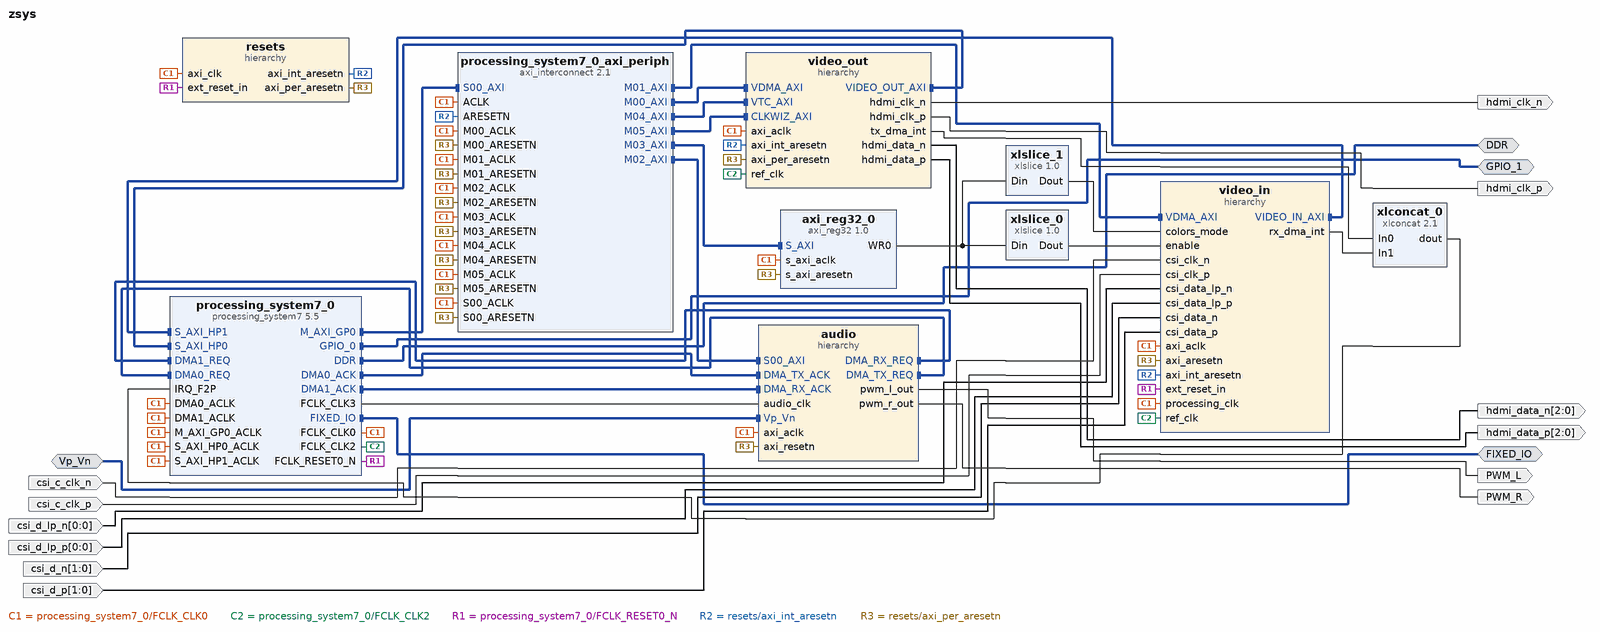
[diagram p0: block diagram of the top level]
# Vivado block design zsys, xc7z010clg225-1, Vivado 2017.1
create_bd_design zsys

create_bd_intf_port -mode Master -vlnv xilinx.com:interface:gpio_rtl:1.0 GPIO_1
create_bd_intf_port -mode Slave -vlnv xilinx.com:interface:diff_analog_io_rtl:1.0 Vp_Vn
create_bd_intf_port -mode Master -vlnv xilinx.com:interface:ddrx_rtl:1.0 DDR
create_bd_intf_port -mode Master -vlnv xilinx.com:display_processing_system7:fixedio_rtl:1.0 FIXED_IO
create_bd_port -dir O PWM_L
create_bd_port -dir O PWM_R
create_bd_port -dir I csi_c_clk_n
create_bd_port -dir I csi_c_clk_p
create_bd_port -dir I -from 0 -to 0 csi_d_lp_n
create_bd_port -dir I -from 0 -to 0 csi_d_lp_p
create_bd_port -dir I -from 1 -to 0 csi_d_n
create_bd_port -dir I -from 1 -to 0 csi_d_p
create_bd_port -dir O hdmi_clk_n
create_bd_port -dir O hdmi_clk_p
create_bd_port -dir O -from 2 -to 0 hdmi_data_n
create_bd_port -dir O -from 2 -to 0 hdmi_data_p

create_bd_cell -type hier audio
create_bd_cell -type ip -vlnv trenz.biz:user:axi_reg32:1.0 axi_reg32_0
set_property -dict {CONFIG.C_NUM_RO_REG 1 CONFIG.C_NUM_WR_REG 1} [get_bd_cells axi_reg32_0]
create_bd_cell -type ip -vlnv xilinx.com:ip:processing_system7:5.5 processing_system7_0
set_property -dict [list \
  CONFIG.PCW_FCLK_CLK1_BUF TRUE \
  CONFIG.PCW_FCLK_CLK2_BUF TRUE \
  CONFIG.PCW_FCLK_CLK3_BUF TRUE \
  CONFIG.PCW_I2C_PERIPHERAL_FREQMHZ 111.111115 \
  CONFIG.PCW_FPGA0_PERIPHERAL_FREQMHZ 160 \
  CONFIG.PCW_FPGA1_PERIPHERAL_FREQMHZ 100 \
  CONFIG.PCW_FPGA2_PERIPHERAL_FREQMHZ 200 \
  CONFIG.PCW_FPGA3_PERIPHERAL_FREQMHZ 12.288 \
  CONFIG.PCW_USE_S_AXI_HP0 1 \
  CONFIG.PCW_USE_S_AXI_HP1 1 \
  CONFIG.PCW_USE_DMA0 1 \
  CONFIG.PCW_USE_DMA1 1 \
  CONFIG.PCW_USE_FABRIC_INTERRUPT 1 \
  CONFIG.PCW_GPIO_EMIO_GPIO_WIDTH 24 \
  CONFIG.PCW_S_AXI_HP0_DATA_WIDTH 32 \
  CONFIG.PCW_DQ_WIDTH 16 \
  CONFIG.PCW_DQS_WIDTH 2 \
  CONFIG.PCW_DM_WIDTH 2 \
  CONFIG.PCW_MIO_PRIMITIVE 32 \
  CONFIG.PCW_EN_CLK1_PORT 1 \
  CONFIG.PCW_EN_CLK2_PORT 1 \
  CONFIG.PCW_EN_CLK3_PORT 1 \
  CONFIG.PCW_IRQ_F2P_INTR 1 \
  CONFIG.PCW_PERIPHERAL_BOARD_PRESET part0 \
  CONFIG.PCW_UIPARAM_DDR_MEMORY_TYPE {DDR 3 (Low Voltage)} \
  CONFIG.PCW_UIPARAM_DDR_BUS_WIDTH {16 Bit} \
  CONFIG.PCW_UIPARAM_DDR_PARTNO {MT41J256M16 RE-125} \
  CONFIG.PCW_QSPI_PERIPHERAL_ENABLE 1 \
  CONFIG.PCW_QSPI_QSPI_IO {MIO 1 .. 6} \
  CONFIG.PCW_QSPI_GRP_SINGLE_SS_ENABLE 1 \
  CONFIG.PCW_QSPI_GRP_SINGLE_SS_IO {MIO 1 .. 6} \
  CONFIG.PCW_SD1_PERIPHERAL_ENABLE 1 \
  CONFIG.PCW_SD1_SD1_IO {MIO 10 .. 15} \
  CONFIG.PCW_SD1_GRP_CD_ENABLE 1 \
  CONFIG.PCW_SD1_GRP_CD_IO {MIO 0} \
  CONFIG.PCW_UART1_PERIPHERAL_ENABLE 1 \
  CONFIG.PCW_UART1_UART1_IO {MIO 8 .. 9} \
  CONFIG.PCW_TTC0_PERIPHERAL_ENABLE 1 \
  CONFIG.PCW_TTC0_TTC0_IO EMIO \
  CONFIG.PCW_USB0_PERIPHERAL_ENABLE 1 \
  CONFIG.PCW_USB0_USB0_IO {MIO 28 .. 39} \
  CONFIG.PCW_USB_RESET_ENABLE 1 \
  CONFIG.PCW_USB_RESET_SELECT {Share reset pin} \
  CONFIG.PCW_USB0_RESET_ENABLE 1 \
  CONFIG.PCW_USB0_RESET_IO {MIO 7} \
  CONFIG.PCW_I2C0_PERIPHERAL_ENABLE 1 \
  CONFIG.PCW_I2C0_I2C0_IO EMIO \
  CONFIG.PCW_I2C1_PERIPHERAL_ENABLE 1 \
  CONFIG.PCW_I2C1_I2C1_IO {MIO 48 .. 49} \
  CONFIG.PCW_I2C1_GRP_INT_ENABLE 1 \
  CONFIG.PCW_I2C1_GRP_INT_IO EMIO \
  CONFIG.PCW_I2C_RESET_ENABLE 0 \
  CONFIG.PCW_GPIO_MIO_GPIO_ENABLE 1 \
  CONFIG.PCW_GPIO_MIO_GPIO_IO MIO \
  CONFIG.PCW_GPIO_EMIO_GPIO_ENABLE 1 \
  CONFIG.PCW_GPIO_EMIO_GPIO_IO 24 \
  CONFIG.PCW_ENET0_PERIPHERAL_CLKSRC External \
  CONFIG.PCW_UIPARAM_GENERATE_SUMMARY NONE \
  CONFIG.PCW_FPGA_FCLK1_ENABLE 1 \
  CONFIG.PCW_FPGA_FCLK2_ENABLE 1 \
  CONFIG.PCW_FPGA_FCLK3_ENABLE 1 \
] [get_bd_cells processing_system7_0]
# 161 more settings of processing_system7_0 are not shown: defaults, MIO pin electricals, DDR timing, and values the tool derives
create_bd_cell -type ip -vlnv xilinx.com:ip:axi_interconnect:2.1 processing_system7_0_axi_periph
set_property -dict {CONFIG.NUM_MI 6} [get_bd_cells processing_system7_0_axi_periph]
create_bd_cell -type hier resets
create_bd_cell -type hier video_in
create_bd_cell -type hier video_out
create_bd_cell -type ip -vlnv xilinx.com:ip:xlconcat:2.1 xlconcat_0
set_property -dict {CONFIG.NUM_PORTS 2} [get_bd_cells xlconcat_0]
create_bd_cell -type ip -vlnv xilinx.com:ip:xlslice:1.0 xlslice_0
set_property -dict {CONFIG.DIN_TO 0 CONFIG.DIN_FROM 0 CONFIG.DIN_WIDTH 32} [get_bd_cells xlslice_0]
create_bd_cell -type ip -vlnv xilinx.com:ip:xlslice:1.0 xlslice_1
set_property -dict {CONFIG.DIN_TO 1 CONFIG.DIN_FROM 1 CONFIG.DIN_WIDTH 32 CONFIG.DOUT_WIDTH 1} [get_bd_cells xlslice_1]

# ---- hierarchy /audio ----
current_bd_instance /audio
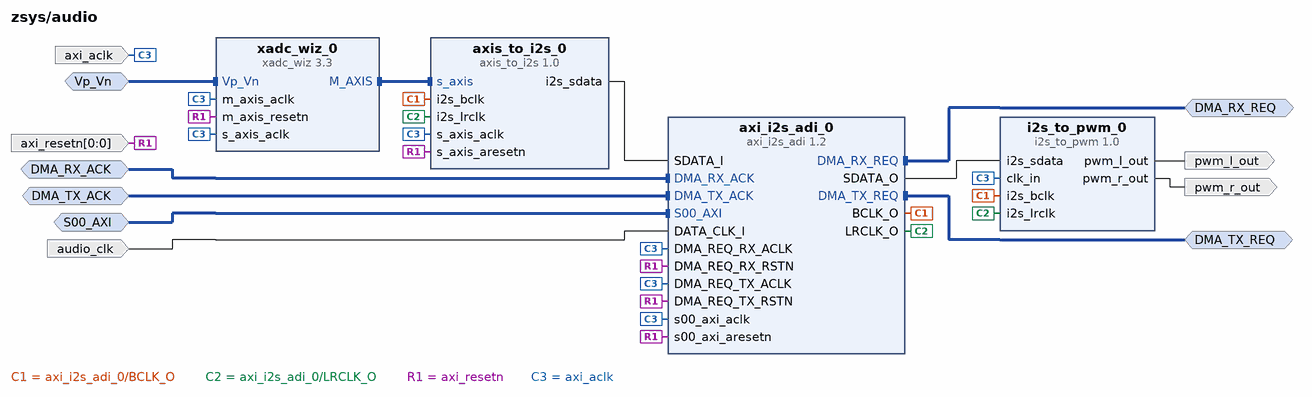
[diagram p1: block diagram inside /audio]
create_bd_intf_pin -mode Slave -vlnv xilinx.com:interface:axis_rtl:1.0 DMA_RX_ACK
create_bd_intf_pin -mode Master -vlnv xilinx.com:interface:axis_rtl:1.0 DMA_RX_REQ
create_bd_intf_pin -mode Slave -vlnv xilinx.com:interface:axis_rtl:1.0 DMA_TX_ACK
create_bd_intf_pin -mode Master -vlnv xilinx.com:interface:axis_rtl:1.0 DMA_TX_REQ
create_bd_intf_pin -mode Slave -vlnv xilinx.com:interface:aximm_rtl:1.0 S00_AXI
create_bd_intf_pin -mode Slave -vlnv xilinx.com:interface:diff_analog_io_rtl:1.0 Vp_Vn
create_bd_pin -dir I audio_clk
create_bd_pin -dir I -type clk axi_aclk
create_bd_pin -dir I -from 0 -to 0 -type rst axi_resetn
create_bd_pin -dir O pwm_l_out
create_bd_pin -dir O pwm_r_out

create_bd_cell -type ip -vlnv digilentinc.com:user:axi_i2s_adi:1.2 axi_i2s_adi_0
set_property -dict {CONFIG.C_DMA_TYPE 1} [get_bd_cells axi_i2s_adi_0]
create_bd_cell -type ip -vlnv trenz.biz:user:axis_to_i2s:1.0 axis_to_i2s_0
create_bd_cell -type ip -vlnv trenz.biz:user:i2s_to_pwm:1.0 i2s_to_pwm_0
create_bd_cell -type ip -vlnv xilinx.com:ip:xadc_wiz:3.3 xadc_wiz_0
set_property -dict [list \
  CONFIG.INTERFACE_SELECTION None \
  CONFIG.DCLK_FREQUENCY 150 \
  CONFIG.ADC_CONVERSION_RATE 1000 \
  CONFIG.ENABLE_RESET true \
  CONFIG.OT_ALARM false \
  CONFIG.USER_TEMP_ALARM false \
  CONFIG.VCCINT_ALARM false \
  CONFIG.VCCAUX_ALARM false \
  CONFIG.ENABLE_VCCPINT_ALARM false \
  CONFIG.ENABLE_VCCPAUX_ALARM false \
  CONFIG.ENABLE_VCCDDRO_ALARM false \
  CONFIG.SINGLE_CHANNEL_SELECTION VP_VN \
  CONFIG.ENABLE_AXI4STREAM true \
] [get_bd_cells xadc_wiz_0]

# ---- hierarchy /resets ----
current_bd_instance /resets
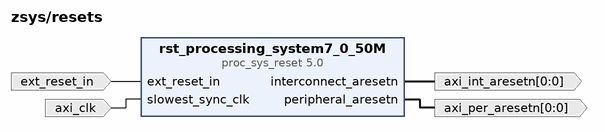
[diagram p2: block diagram inside /resets]
create_bd_pin -dir I -type clk axi_clk
create_bd_pin -dir O -from 0 -to 0 -type rst axi_int_aresetn
create_bd_pin -dir O -from 0 -to 0 -type rst axi_per_aresetn
create_bd_pin -dir I -type rst ext_reset_in

create_bd_cell -type ip -vlnv xilinx.com:ip:proc_sys_reset:5.0 rst_processing_system7_0_50M

# ---- hierarchy /video_in ----
current_bd_instance /video_in
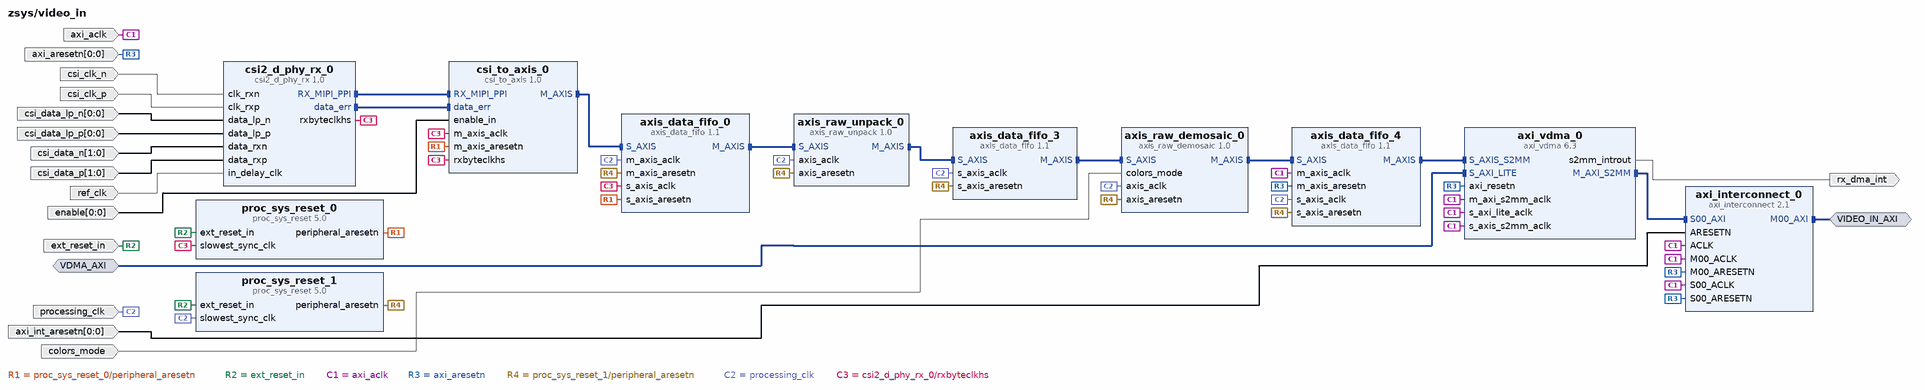
[diagram p3: block diagram inside /video_in]
create_bd_intf_pin -mode Slave -vlnv xilinx.com:interface:aximm_rtl:1.0 VDMA_AXI
create_bd_intf_pin -mode Master -vlnv xilinx.com:interface:aximm_rtl:1.0 VIDEO_IN_AXI
create_bd_pin -dir I -type clk axi_aclk
create_bd_pin -dir I -from 0 -to 0 -type rst axi_aresetn
create_bd_pin -dir I -from 0 -to 0 axi_int_aresetn
create_bd_pin -dir I colors_mode
create_bd_pin -dir I csi_clk_n
create_bd_pin -dir I csi_clk_p
create_bd_pin -dir I -from 0 -to 0 csi_data_lp_n
create_bd_pin -dir I -from 0 -to 0 csi_data_lp_p
create_bd_pin -dir I -from 1 -to 0 csi_data_n
create_bd_pin -dir I -from 1 -to 0 csi_data_p
create_bd_pin -dir I -from 0 -to 0 enable
create_bd_pin -dir I -type rst ext_reset_in
create_bd_pin -dir I processing_clk
create_bd_pin -dir I ref_clk
create_bd_pin -dir O rx_dma_int

create_bd_cell -type ip -vlnv xilinx.com:ip:axi_interconnect:2.1 axi_interconnect_0
set_property -dict {CONFIG.NUM_MI 1} [get_bd_cells axi_interconnect_0]
create_bd_cell -type ip -vlnv xilinx.com:ip:axi_vdma:6.3 axi_vdma_0
set_property -dict [list \
  CONFIG.c_m_axi_s2mm_data_width 64 \
  CONFIG.c_include_s2mm_dre 1 \
  CONFIG.c_num_fstores 1 \
  CONFIG.c_s2mm_genlock_mode 0 \
  CONFIG.c_s2mm_linebuffer_depth 4096 \
  CONFIG.c_include_mm2s 0 \
  CONFIG.c_s2mm_max_burst_length 32 \
] [get_bd_cells axi_vdma_0]
create_bd_cell -type ip -vlnv xilinx.com:ip:axis_data_fifo:1.1 axis_data_fifo_0
set_property -dict [list \
  CONFIG.TDATA_NUM_BYTES 2 \
  CONFIG.TUSER_WIDTH 1 \
  CONFIG.FIFO_DEPTH 16384 \
  CONFIG.IS_ACLK_ASYNC 1 \
  CONFIG.HAS_TLAST 1 \
] [get_bd_cells axis_data_fifo_0]
create_bd_cell -type ip -vlnv xilinx.com:ip:axis_data_fifo:1.1 axis_data_fifo_3
create_bd_cell -type ip -vlnv xilinx.com:ip:axis_data_fifo:1.1 axis_data_fifo_4
set_property -dict {CONFIG.FIFO_DEPTH 4096 CONFIG.IS_ACLK_ASYNC 1} [get_bd_cells axis_data_fifo_4]
create_bd_cell -type ip -vlnv trenz.biz:user:axis_raw_demosaic:1.0 axis_raw_demosaic_0
set_property -dict {CONFIG.C_MODE 1 CONFIG.C_IN_TYPE 1 CONFIG.C_COLOR_POS 2} [get_bd_cells axis_raw_demosaic_0]
create_bd_cell -type ip -vlnv trenz.biz:user:axis_raw_unpack:1.0 axis_raw_unpack_0
set_property -dict {CONFIG.C_IMP_TYPE 1 CONFIG.C_OUT_TYPE 1} [get_bd_cells axis_raw_unpack_0]
create_bd_cell -type ip -vlnv trenz.biz:user:csi2_d_phy_rx:1.0 csi2_d_phy_rx_0
set_property -dict [list \
  CONFIG.C_NUM_LP_LANES 1 \
  CONFIG.C_ADD_IDELAYCTRL true \
  CONFIG.C_USE_DELAY true \
  CONFIG.C_CALIB_WAIT 8191 \
  CONFIG.C_RATE_LIMIT 50 \
] [get_bd_cells csi2_d_phy_rx_0]
create_bd_cell -type ip -vlnv trenz.biz:user:csi_to_axis:1.0 csi_to_axis_0
set_property -dict {CONFIG.C_TIMEOUT 255} [get_bd_cells csi_to_axis_0]
create_bd_cell -type ip -vlnv xilinx.com:ip:proc_sys_reset:5.0 proc_sys_reset_0
create_bd_cell -type ip -vlnv xilinx.com:ip:proc_sys_reset:5.0 proc_sys_reset_1

# ---- hierarchy /video_out ----
current_bd_instance /video_out
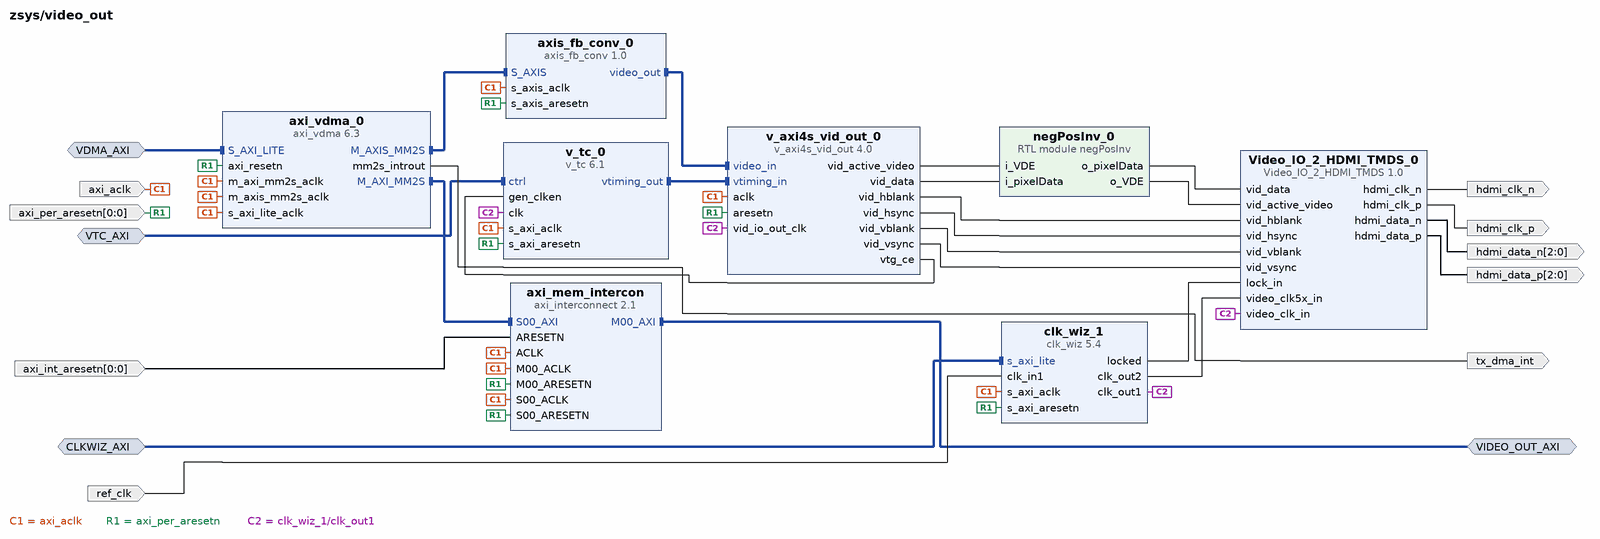
[diagram p4: block diagram inside /video_out]
create_bd_intf_pin -mode Slave -vlnv xilinx.com:interface:aximm_rtl:1.0 CLKWIZ_AXI
create_bd_intf_pin -mode Slave -vlnv xilinx.com:interface:aximm_rtl:1.0 VDMA_AXI
create_bd_intf_pin -mode Master -vlnv xilinx.com:interface:aximm_rtl:1.0 VIDEO_OUT_AXI
create_bd_intf_pin -mode Slave -vlnv xilinx.com:interface:aximm_rtl:1.0 VTC_AXI
create_bd_pin -dir I -type clk axi_aclk
create_bd_pin -dir I -from 0 -to 0 -type rst axi_int_aresetn
create_bd_pin -dir I -from 0 -to 0 -type rst axi_per_aresetn
create_bd_pin -dir I -type clk ref_clk
create_bd_pin -dir O -type intr tx_dma_int
create_bd_pin -dir O hdmi_clk_n
create_bd_pin -dir O hdmi_clk_p
create_bd_pin -dir O -from 2 -to 0 hdmi_data_n
create_bd_pin -dir O -from 2 -to 0 hdmi_data_p

create_bd_cell -type ip -vlnv xilinx.com:ip:axi_interconnect:2.1 axi_mem_intercon
set_property -dict {CONFIG.NUM_MI 1} [get_bd_cells axi_mem_intercon]
create_bd_cell -type ip -vlnv xilinx.com:ip:axi_vdma:6.3 axi_vdma_0
set_property -dict [list \
  CONFIG.c_m_axi_mm2s_data_width 32 \
  CONFIG.c_num_fstores 1 \
  CONFIG.c_mm2s_genlock_mode 0 \
  CONFIG.c_mm2s_linebuffer_depth 1024 \
  CONFIG.c_mm2s_max_burst_length 16 \
  CONFIG.c_include_s2mm 0 \
] [get_bd_cells axi_vdma_0]
create_bd_cell -type ip -vlnv trenz.biz:user:axis_fb_conv:1.0 axis_fb_conv_0
create_bd_cell -type ip -vlnv xilinx.com:ip:clk_wiz:5.4 clk_wiz_1
set_property -dict [list \
  CONFIG.USE_DYN_RECONFIG true \
  CONFIG.JITTER_SEL Min_O_Jitter \
  CONFIG.CLKIN1_JITTER_PS 50.0 \
  CONFIG.CLKOUT2_USED true \
  CONFIG.CLKOUT3_USED false \
  CONFIG.CLKOUT4_USED false \
  CONFIG.NUM_OUT_CLKS 2 \
  CONFIG.CLKOUT1_REQUESTED_OUT_FREQ 74.250 \
  CONFIG.CLKOUT2_REQUESTED_OUT_FREQ 371.250 \
  CONFIG.CLKOUT3_REQUESTED_OUT_FREQ 100.000 \
  CONFIG.CLKOUT4_REQUESTED_OUT_FREQ 100.000 \
  CONFIG.MMCM_DIVCLK_DIVIDE 10 \
  CONFIG.MMCM_BANDWIDTH HIGH \
  CONFIG.MMCM_CLKFBOUT_MULT_F 37.125 \
  CONFIG.MMCM_CLKIN1_PERIOD 5.000 \
  CONFIG.MMCM_CLKIN2_PERIOD 10.0 \
  CONFIG.MMCM_CLKOUT0_DIVIDE_F 10.000 \
  CONFIG.MMCM_CLKOUT1_DIVIDE 2 \
  CONFIG.MMCM_CLKOUT2_DIVIDE 1 \
  CONFIG.MMCM_CLKOUT3_DIVIDE 1 \
  CONFIG.CLKOUT1_JITTER 333.287 \
  CONFIG.CLKOUT1_PHASE_ERROR 322.999 \
  CONFIG.CLKOUT2_JITTER 256.477 \
  CONFIG.CLKOUT2_PHASE_ERROR 322.999 \
  CONFIG.CLKOUT3_JITTER 325.031 \
  CONFIG.CLKOUT3_PHASE_ERROR 569.784 \
  CONFIG.CLKOUT4_JITTER 357.108 \
  CONFIG.CLKOUT4_PHASE_ERROR 569.784 \
] [get_bd_cells clk_wiz_1]
create_bd_cell -type ip -vlnv xilinx.com:ip:v_tc:6.1 v_tc_0
set_property -dict [list \
  CONFIG.HAS_AXI4_LITE true \
  CONFIG.max_clocks_per_line 4096 \
  CONFIG.max_lines_per_frame 2048 \
  CONFIG.VIDEO_MODE 720p \
  CONFIG.enable_detection false \
] [get_bd_cells v_tc_0]
create_bd_cell -type ip -vlnv xilinx.com:ip:v_axi4s_vid_out:4.0 v_axi4s_vid_out_0
set_property -dict {CONFIG.C_HAS_ASYNC_CLK 1} [get_bd_cells v_axi4s_vid_out_0]
create_bd_cell -type ip -vlnv trenz.biz:user:Video_IO_2_HDMI_TMDS:1.0 Video_IO_2_HDMI_TMDS_0
set_property -dict [list \
  CONFIG.C_CLK_SWAP true \
  CONFIG.C_D0_SWAP true \
  CONFIG.C_INT_CLOCKING false \
] [get_bd_cells Video_IO_2_HDMI_TMDS_0]
create_bd_cell -type module -reference negPosInv negPosInv_0

# ---- connections ----

current_bd_instance /audio
connect_bd_intf_net [get_bd_intf_pins axis_to_i2s_0/s_axis] [get_bd_intf_pins xadc_wiz_0/M_AXIS]
connect_bd_intf_net [get_bd_intf_pins DMA_RX_ACK] [get_bd_intf_pins axi_i2s_adi_0/DMA_RX_ACK]
connect_bd_intf_net [get_bd_intf_pins DMA_RX_REQ] [get_bd_intf_pins axi_i2s_adi_0/DMA_RX_REQ]
connect_bd_intf_net [get_bd_intf_pins DMA_TX_ACK] [get_bd_intf_pins axi_i2s_adi_0/DMA_TX_ACK]
connect_bd_intf_net [get_bd_intf_pins DMA_TX_REQ] [get_bd_intf_pins axi_i2s_adi_0/DMA_TX_REQ]
connect_bd_intf_net [get_bd_intf_pins S00_AXI] [get_bd_intf_pins axi_i2s_adi_0/S00_AXI]
connect_bd_intf_net [get_bd_intf_pins Vp_Vn] [get_bd_intf_pins xadc_wiz_0/Vp_Vn]
connect_bd_net -net BCLK [get_bd_pins axi_i2s_adi_0/BCLK_O] [get_bd_pins axis_to_i2s_0/i2s_bclk] [get_bd_pins i2s_to_pwm_0/i2s_bclk]
connect_bd_net -net DATA_CLK_I_1 [get_bd_pins audio_clk] [get_bd_pins axi_i2s_adi_0/DATA_CLK_I]
connect_bd_net -net LRCLK [get_bd_pins axi_i2s_adi_0/LRCLK_O] [get_bd_pins axis_to_i2s_0/i2s_lrclk] [get_bd_pins i2s_to_pwm_0/i2s_lrclk]
connect_bd_net [get_bd_pins i2s_to_pwm_0/pwm_l_out] [get_bd_pins pwm_l_out]
connect_bd_net [get_bd_pins i2s_to_pwm_0/pwm_r_out] [get_bd_pins pwm_r_out]
connect_bd_net -net m_axis_resetn_1 [get_bd_pins axi_resetn] \
  [get_bd_pins axi_i2s_adi_0/DMA_REQ_RX_RSTN] [get_bd_pins axi_i2s_adi_0/DMA_REQ_TX_RSTN] \
  [get_bd_pins axi_i2s_adi_0/s00_axi_aresetn] [get_bd_pins axis_to_i2s_0/s_axis_aresetn] \
  [get_bd_pins xadc_wiz_0/m_axis_resetn]
connect_bd_net -net play_sdata [get_bd_pins axi_i2s_adi_0/SDATA_O] [get_bd_pins i2s_to_pwm_0/i2s_sdata]
connect_bd_net -net rec_sdata [get_bd_pins axis_to_i2s_0/i2s_sdata] [get_bd_pins axi_i2s_adi_0/SDATA_I]
connect_bd_net -net s_axis_aclk_1 [get_bd_pins axi_aclk] \
  [get_bd_pins axi_i2s_adi_0/DMA_REQ_RX_ACLK] [get_bd_pins axi_i2s_adi_0/DMA_REQ_TX_ACLK] \
  [get_bd_pins axi_i2s_adi_0/s00_axi_aclk] [get_bd_pins axis_to_i2s_0/s_axis_aclk] [get_bd_pins i2s_to_pwm_0/clk_in] \
  [get_bd_pins xadc_wiz_0/m_axis_aclk] [get_bd_pins xadc_wiz_0/s_axis_aclk]

current_bd_instance /resets
connect_bd_net [get_bd_pins ext_reset_in] [get_bd_pins rst_processing_system7_0_50M/ext_reset_in]
connect_bd_net [get_bd_pins rst_processing_system7_0_50M/interconnect_aresetn] [get_bd_pins axi_int_aresetn]
connect_bd_net [get_bd_pins rst_processing_system7_0_50M/peripheral_aresetn] [get_bd_pins axi_per_aresetn]
connect_bd_net -net slowest_sync_clk_1 [get_bd_pins axi_clk] [get_bd_pins rst_processing_system7_0_50M/slowest_sync_clk]

current_bd_instance /video_in
connect_bd_intf_net [get_bd_intf_pins axis_data_fifo_0/S_AXIS] [get_bd_intf_pins csi_to_axis_0/M_AXIS]
connect_bd_intf_net [get_bd_intf_pins axi_interconnect_0/S00_AXI] [get_bd_intf_pins axi_vdma_0/M_AXI_S2MM]
connect_bd_intf_net [get_bd_intf_pins axis_data_fifo_0/M_AXIS] [get_bd_intf_pins axis_raw_unpack_0/S_AXIS]
connect_bd_intf_net [get_bd_intf_pins axis_data_fifo_3/M_AXIS] [get_bd_intf_pins axis_raw_demosaic_0/S_AXIS]
connect_bd_intf_net [get_bd_intf_pins axi_vdma_0/S_AXIS_S2MM] [get_bd_intf_pins axis_data_fifo_4/M_AXIS]
connect_bd_intf_net [get_bd_intf_pins axis_data_fifo_4/S_AXIS] [get_bd_intf_pins axis_raw_demosaic_0/M_AXIS]
connect_bd_intf_net [get_bd_intf_pins axis_data_fifo_3/S_AXIS] [get_bd_intf_pins axis_raw_unpack_0/M_AXIS]
connect_bd_intf_net [get_bd_intf_pins csi2_d_phy_rx_0/RX_MIPI_PPI] [get_bd_intf_pins csi_to_axis_0/RX_MIPI_PPI]
connect_bd_intf_net [get_bd_intf_pins csi2_d_phy_rx_0/data_err] [get_bd_intf_pins csi_to_axis_0/data_err]
connect_bd_intf_net [get_bd_intf_pins VDMA_AXI] [get_bd_intf_pins axi_vdma_0/S_AXI_LITE]
connect_bd_intf_net [get_bd_intf_pins VIDEO_IN_AXI] [get_bd_intf_pins axi_interconnect_0/M00_AXI]
connect_bd_net -net CSI_AXIS_RSTN [get_bd_pins proc_sys_reset_0/peripheral_aresetn] \
  [get_bd_pins axis_data_fifo_0/s_axis_aresetn] [get_bd_pins csi_to_axis_0/m_axis_aresetn]
connect_bd_net -net ENABLE_STREAM [get_bd_pins enable] [get_bd_pins csi_to_axis_0/enable_in]
connect_bd_net [get_bd_pins axi_int_aresetn] [get_bd_pins axi_interconnect_0/ARESETN]
connect_bd_net [get_bd_pins axi_vdma_0/s2mm_introut] [get_bd_pins rx_dma_int]
connect_bd_net [get_bd_pins colors_mode] [get_bd_pins axis_raw_demosaic_0/colors_mode]
connect_bd_net [get_bd_pins csi_clk_n] [get_bd_pins csi2_d_phy_rx_0/clk_rxn]
connect_bd_net [get_bd_pins csi_clk_p] [get_bd_pins csi2_d_phy_rx_0/clk_rxp]
connect_bd_net [get_bd_pins csi_data_lp_n] [get_bd_pins csi2_d_phy_rx_0/data_lp_n]
connect_bd_net [get_bd_pins csi_data_lp_p] [get_bd_pins csi2_d_phy_rx_0/data_lp_p]
connect_bd_net [get_bd_pins csi_data_n] [get_bd_pins csi2_d_phy_rx_0/data_rxn]
connect_bd_net [get_bd_pins csi_data_p] [get_bd_pins csi2_d_phy_rx_0/data_rxp]
connect_bd_net [get_bd_pins ext_reset_in] [get_bd_pins proc_sys_reset_0/ext_reset_in] [get_bd_pins proc_sys_reset_1/ext_reset_in]
connect_bd_net -net m_axi_aclk [get_bd_pins axi_aclk] \
  [get_bd_pins axi_vdma_0/m_axi_s2mm_aclk] [get_bd_pins axi_vdma_0/s_axi_lite_aclk] [get_bd_pins axi_vdma_0/s_axis_s2mm_aclk] \
  [get_bd_pins axis_data_fifo_4/m_axis_aclk] [get_bd_pins axi_interconnect_0/ACLK] [get_bd_pins axi_interconnect_0/M00_ACLK] \
  [get_bd_pins axi_interconnect_0/S00_ACLK]
connect_bd_net -net m_axis_aresetn_1 [get_bd_pins axi_aresetn] \
  [get_bd_pins axi_vdma_0/axi_resetn] [get_bd_pins axis_data_fifo_4/m_axis_aresetn] \
  [get_bd_pins axi_interconnect_0/M00_ARESETN] [get_bd_pins axi_interconnect_0/S00_ARESETN]
connect_bd_net [get_bd_pins proc_sys_reset_1/peripheral_aresetn] \
  [get_bd_pins axis_data_fifo_0/m_axis_aresetn] [get_bd_pins axis_data_fifo_3/s_axis_aresetn] \
  [get_bd_pins axis_data_fifo_4/s_axis_aresetn] [get_bd_pins axis_raw_demosaic_0/axis_aresetn] \
  [get_bd_pins axis_raw_unpack_0/axis_aresetn]
connect_bd_net [get_bd_pins processing_clk] \
  [get_bd_pins axis_data_fifo_0/m_axis_aclk] [get_bd_pins axis_data_fifo_3/s_axis_aclk] \
  [get_bd_pins axis_data_fifo_4/s_axis_aclk] [get_bd_pins axis_raw_demosaic_0/axis_aclk] \
  [get_bd_pins axis_raw_unpack_0/axis_aclk] [get_bd_pins proc_sys_reset_1/slowest_sync_clk]
connect_bd_net -net ref_clk_in_1 [get_bd_pins ref_clk] [get_bd_pins csi2_d_phy_rx_0/in_delay_clk]
connect_bd_net -net s_axis_aclk_1 [get_bd_pins csi2_d_phy_rx_0/rxbyteclkhs] \
  [get_bd_pins axis_data_fifo_0/s_axis_aclk] [get_bd_pins csi_to_axis_0/m_axis_aclk] [get_bd_pins csi_to_axis_0/rxbyteclkhs] \
  [get_bd_pins proc_sys_reset_0/slowest_sync_clk]

current_bd_instance /video_out
connect_bd_intf_net [get_bd_intf_pins axi_vdma_0/M_AXIS_MM2S] [get_bd_intf_pins axis_fb_conv_0/S_AXIS]
connect_bd_intf_net [get_bd_intf_pins axi_mem_intercon/S00_AXI] [get_bd_intf_pins axi_vdma_0/M_AXI_MM2S]
connect_bd_intf_net [get_bd_intf_pins v_tc_0/vtiming_out] [get_bd_intf_pins v_axi4s_vid_out_0/vtiming_in]
connect_bd_intf_net [get_bd_intf_pins axis_fb_conv_0/video_out] [get_bd_intf_pins v_axi4s_vid_out_0/video_in]
connect_bd_intf_net [get_bd_intf_pins CLKWIZ_AXI] [get_bd_intf_pins clk_wiz_1/s_axi_lite]
connect_bd_intf_net [get_bd_intf_pins VDMA_AXI] [get_bd_intf_pins axi_vdma_0/S_AXI_LITE]
connect_bd_intf_net [get_bd_intf_pins VIDEO_OUT_AXI] [get_bd_intf_pins axi_mem_intercon/M00_AXI]
connect_bd_intf_net [get_bd_intf_pins VTC_AXI] [get_bd_intf_pins v_tc_0/ctrl]
connect_bd_net -net ARESETN_2 [get_bd_pins axi_int_aresetn] [get_bd_pins axi_mem_intercon/ARESETN]
connect_bd_net -net aclk_1 [get_bd_pins axi_aclk] \
  [get_bd_pins axi_vdma_0/m_axi_mm2s_aclk] [get_bd_pins axi_vdma_0/m_axis_mm2s_aclk] [get_bd_pins axi_vdma_0/s_axi_lite_aclk] \
  [get_bd_pins axis_fb_conv_0/s_axis_aclk] [get_bd_pins clk_wiz_1/s_axi_aclk] [get_bd_pins v_tc_0/s_axi_aclk] \
  [get_bd_pins axi_mem_intercon/ACLK] [get_bd_pins axi_mem_intercon/M00_ACLK] [get_bd_pins axi_mem_intercon/S00_ACLK] \
  [get_bd_pins v_axi4s_vid_out_0/aclk]
connect_bd_net -net aresetn_1 [get_bd_pins axi_per_aresetn] \
  [get_bd_pins axi_vdma_0/axi_resetn] [get_bd_pins axis_fb_conv_0/s_axis_aresetn] [get_bd_pins clk_wiz_1/s_axi_aresetn] \
  [get_bd_pins v_tc_0/s_axi_aresetn] [get_bd_pins axi_mem_intercon/M00_ARESETN] [get_bd_pins axi_mem_intercon/S00_ARESETN] \
  [get_bd_pins v_axi4s_vid_out_0/aresetn]
connect_bd_net [get_bd_pins axi_vdma_0/mm2s_introut] [get_bd_pins tx_dma_int]
connect_bd_net -net clk_in1_1 [get_bd_pins ref_clk] [get_bd_pins clk_wiz_1/clk_in1]
connect_bd_net -net video_clk_in_1 [get_bd_pins clk_wiz_1/clk_out1] \
  [get_bd_pins v_tc_0/clk] [get_bd_pins v_axi4s_vid_out_0/vid_io_out_clk] [get_bd_pins Video_IO_2_HDMI_TMDS_0/video_clk_in]
connect_bd_net [get_bd_pins v_axi4s_vid_out_0/vtg_ce] [get_bd_pins v_tc_0/gen_clken]
connect_bd_net [get_bd_pins v_axi4s_vid_out_0/vid_active_video] [get_bd_pins negPosInv_0/i_VDE]
connect_bd_net [get_bd_pins v_axi4s_vid_out_0/vid_data] [get_bd_pins negPosInv_0/i_pixelData]
connect_bd_net [get_bd_pins Video_IO_2_HDMI_TMDS_0/hdmi_clk_n] [get_bd_pins hdmi_clk_n]
connect_bd_net [get_bd_pins Video_IO_2_HDMI_TMDS_0/hdmi_clk_p] [get_bd_pins hdmi_clk_p]
connect_bd_net [get_bd_pins Video_IO_2_HDMI_TMDS_0/hdmi_data_n] [get_bd_pins hdmi_data_n]
connect_bd_net [get_bd_pins Video_IO_2_HDMI_TMDS_0/hdmi_data_p] [get_bd_pins hdmi_data_p]
connect_bd_net [get_bd_pins negPosInv_0/o_pixelData] [get_bd_pins Video_IO_2_HDMI_TMDS_0/vid_data]
connect_bd_net [get_bd_pins clk_wiz_1/locked] [get_bd_pins Video_IO_2_HDMI_TMDS_0/lock_in]
connect_bd_net [get_bd_pins clk_wiz_1/clk_out2] [get_bd_pins Video_IO_2_HDMI_TMDS_0/video_clk5x_in]
connect_bd_net [get_bd_pins negPosInv_0/o_VDE] [get_bd_pins Video_IO_2_HDMI_TMDS_0/vid_active_video]
connect_bd_net [get_bd_pins v_axi4s_vid_out_0/vid_hblank] [get_bd_pins Video_IO_2_HDMI_TMDS_0/vid_hblank]
connect_bd_net [get_bd_pins v_axi4s_vid_out_0/vid_hsync] [get_bd_pins Video_IO_2_HDMI_TMDS_0/vid_hsync]
connect_bd_net [get_bd_pins v_axi4s_vid_out_0/vid_vblank] [get_bd_pins Video_IO_2_HDMI_TMDS_0/vid_vblank]
connect_bd_net [get_bd_pins v_axi4s_vid_out_0/vid_vsync] [get_bd_pins Video_IO_2_HDMI_TMDS_0/vid_vsync]

current_bd_instance /
connect_bd_intf_net [get_bd_intf_pins audio/DMA_RX_REQ] [get_bd_intf_pins processing_system7_0/DMA1_REQ]
connect_bd_intf_net [get_bd_intf_pins audio/DMA_TX_REQ] [get_bd_intf_pins processing_system7_0/DMA0_REQ]
connect_bd_intf_net [get_bd_intf_pins audio/DMA_TX_ACK] [get_bd_intf_pins processing_system7_0/DMA0_ACK]
connect_bd_intf_net [get_bd_intf_pins audio/DMA_RX_ACK] [get_bd_intf_pins processing_system7_0/DMA1_ACK]
connect_bd_intf_net [get_bd_intf_pins processing_system7_0/M_AXI_GP0] [get_bd_intf_pins processing_system7_0_axi_periph/S00_AXI]
connect_bd_intf_net [get_bd_intf_pins processing_system7_0_axi_periph/M00_AXI] [get_bd_intf_pins video_out/VDMA_AXI]
connect_bd_intf_net [get_bd_intf_pins processing_system7_0_axi_periph/M01_AXI] [get_bd_intf_pins video_in/VDMA_AXI]
connect_bd_intf_net [get_bd_intf_pins audio/S00_AXI] [get_bd_intf_pins processing_system7_0_axi_periph/M02_AXI]
connect_bd_intf_net [get_bd_intf_pins axi_reg32_0/S_AXI] [get_bd_intf_pins processing_system7_0_axi_periph/M03_AXI]
connect_bd_intf_net [get_bd_intf_pins processing_system7_0_axi_periph/M04_AXI] [get_bd_intf_pins video_out/VTC_AXI]
connect_bd_intf_net [get_bd_intf_pins processing_system7_0_axi_periph/M05_AXI] [get_bd_intf_pins video_out/CLKWIZ_AXI]
connect_bd_intf_net -intf_net video_in_M00_AXI [get_bd_intf_pins processing_system7_0/S_AXI_HP1] [get_bd_intf_pins video_in/VIDEO_IN_AXI]
connect_bd_intf_net -intf_net video_out_M00_AXI [get_bd_intf_pins processing_system7_0/S_AXI_HP0] [get_bd_intf_pins video_out/VIDEO_OUT_AXI]
connect_bd_intf_net [get_bd_intf_ports GPIO_1] [get_bd_intf_pins processing_system7_0/GPIO_0]
connect_bd_intf_net [get_bd_intf_ports Vp_Vn] [get_bd_intf_pins audio/Vp_Vn]
connect_bd_intf_net [get_bd_intf_ports DDR] [get_bd_intf_pins processing_system7_0/DDR]
connect_bd_intf_net [get_bd_intf_ports FIXED_IO] [get_bd_intf_pins processing_system7_0/FIXED_IO]
connect_bd_net [get_bd_pins audio/pwm_l_out] [get_bd_ports PWM_L]
connect_bd_net [get_bd_pins audio/pwm_r_out] [get_bd_ports PWM_R]
connect_bd_net [get_bd_pins axi_reg32_0/WR0] [get_bd_pins xlslice_0/Din] [get_bd_pins xlslice_1/Din]
connect_bd_net [get_bd_ports csi_c_clk_n] [get_bd_pins video_in/csi_clk_n]
connect_bd_net [get_bd_ports csi_c_clk_p] [get_bd_pins video_in/csi_clk_p]
connect_bd_net [get_bd_ports csi_d_lp_n] [get_bd_pins video_in/csi_data_lp_n]
connect_bd_net [get_bd_ports csi_d_lp_p] [get_bd_pins video_in/csi_data_lp_p]
connect_bd_net [get_bd_ports csi_d_n] [get_bd_pins video_in/csi_data_n]
connect_bd_net [get_bd_ports csi_d_p] [get_bd_pins video_in/csi_data_p]
connect_bd_net [get_bd_pins processing_system7_0/FCLK_CLK0] \
  [get_bd_pins axi_reg32_0/s_axi_aclk] [get_bd_pins processing_system7_0/DMA0_ACLK] \
  [get_bd_pins processing_system7_0/DMA1_ACLK] [get_bd_pins processing_system7_0/M_AXI_GP0_ACLK] \
  [get_bd_pins processing_system7_0/S_AXI_HP0_ACLK] [get_bd_pins processing_system7_0/S_AXI_HP1_ACLK] \
  [get_bd_pins audio/axi_aclk] [get_bd_pins processing_system7_0_axi_periph/ACLK] \
  [get_bd_pins processing_system7_0_axi_periph/M00_ACLK] [get_bd_pins processing_system7_0_axi_periph/M01_ACLK] \
  [get_bd_pins processing_system7_0_axi_periph/M02_ACLK] [get_bd_pins processing_system7_0_axi_periph/M03_ACLK] \
  [get_bd_pins processing_system7_0_axi_periph/M04_ACLK] [get_bd_pins processing_system7_0_axi_periph/M05_ACLK] \
  [get_bd_pins processing_system7_0_axi_periph/S00_ACLK] [get_bd_pins resets/axi_clk] [get_bd_pins video_in/axi_aclk] \
  [get_bd_pins video_in/processing_clk] [get_bd_pins video_out/axi_aclk]
connect_bd_net [get_bd_pins processing_system7_0/FCLK_CLK2] [get_bd_pins video_in/ref_clk] [get_bd_pins video_out/ref_clk]
connect_bd_net [get_bd_pins processing_system7_0/FCLK_CLK3] [get_bd_pins audio/audio_clk]
connect_bd_net [get_bd_pins processing_system7_0/FCLK_RESET0_N] [get_bd_pins resets/ext_reset_in] [get_bd_pins video_in/ext_reset_in]
connect_bd_net -net rst_processing_system7_0_50M_interconnect_aresetn [get_bd_pins resets/axi_int_aresetn] \
  [get_bd_pins processing_system7_0_axi_periph/ARESETN] [get_bd_pins video_in/axi_int_aresetn] \
  [get_bd_pins video_out/axi_int_aresetn]
connect_bd_net -net rst_processing_system7_0_50M_peripheral_aresetn [get_bd_pins resets/axi_per_aresetn] \
  [get_bd_pins axi_reg32_0/s_axi_aresetn] [get_bd_pins audio/axi_resetn] \
  [get_bd_pins processing_system7_0_axi_periph/M00_ARESETN] [get_bd_pins processing_system7_0_axi_periph/M01_ARESETN] \
  [get_bd_pins processing_system7_0_axi_periph/M02_ARESETN] [get_bd_pins processing_system7_0_axi_periph/M03_ARESETN] \
  [get_bd_pins processing_system7_0_axi_periph/M04_ARESETN] [get_bd_pins processing_system7_0_axi_periph/M05_ARESETN] \
  [get_bd_pins processing_system7_0_axi_periph/S00_ARESETN] [get_bd_pins video_in/axi_aresetn] \
  [get_bd_pins video_out/axi_per_aresetn]
connect_bd_net [get_bd_pins video_in/rx_dma_int] [get_bd_pins xlconcat_0/In1]
connect_bd_net -net video_out_mm2s_introut [get_bd_pins video_out/tx_dma_int] [get_bd_pins xlconcat_0/In0]
connect_bd_net [get_bd_pins xlconcat_0/dout] [get_bd_pins processing_system7_0/IRQ_F2P]
connect_bd_net [get_bd_pins xlslice_0/Dout] [get_bd_pins video_in/enable]
connect_bd_net [get_bd_pins xlslice_1/Dout] [get_bd_pins video_in/colors_mode]
connect_bd_net [get_bd_pins video_out/hdmi_clk_n] [get_bd_ports hdmi_clk_n]
connect_bd_net [get_bd_pins video_out/hdmi_clk_p] [get_bd_ports hdmi_clk_p]
connect_bd_net [get_bd_pins video_out/hdmi_data_n] [get_bd_ports hdmi_data_n]
connect_bd_net [get_bd_pins video_out/hdmi_data_p] [get_bd_ports hdmi_data_p]

# ---- address map ----
assign_bd_address -offset 0x43000000 -range 64K -target_address_space [get_bd_addr_spaces processing_system7_0/Data] [get_bd_addr_segs video_out/axi_vdma_0/S_AXI_LITE/Reg]
assign_bd_address -offset 0x43010000 -range 64K -target_address_space [get_bd_addr_spaces processing_system7_0/Data] [get_bd_addr_segs video_in/axi_vdma_0/S_AXI_LITE/Reg]
assign_bd_address -offset 0x43C00000 -range 64K -target_address_space [get_bd_addr_spaces processing_system7_0/Data] [get_bd_addr_segs audio/axi_i2s_adi_0/S00_AXI/S00_AXI_reg]
assign_bd_address -offset 0x43C10000 -range 64K -target_address_space [get_bd_addr_spaces processing_system7_0/Data] [get_bd_addr_segs axi_reg32_0/S_AXI/S_AXI_reg]
assign_bd_address -offset 0x43C20000 -range 64K -target_address_space [get_bd_addr_spaces processing_system7_0/Data] [get_bd_addr_segs video_out/v_tc_0/ctrl/Reg]
assign_bd_address -offset 0x43C30000 -range 64K -target_address_space [get_bd_addr_spaces processing_system7_0/Data] [get_bd_addr_segs video_out/clk_wiz_1/s_axi_lite/Reg]
assign_bd_address -offset 0x00000000 -range 512M -target_address_space [get_bd_addr_spaces video_in/axi_vdma_0/Data_S2MM] [get_bd_addr_segs processing_system7_0/S_AXI_HP1/HP1_DDR_LOWOCM]
assign_bd_address -offset 0x00000000 -range 512M -target_address_space [get_bd_addr_spaces video_out/axi_vdma_0/Data_MM2S] [get_bd_addr_segs processing_system7_0/S_AXI_HP0/HP0_DDR_LOWOCM]

validate_bd_design
save_bd_design
